# Altium schematic sheet 智能家居-开关-功率测量板.SchDoc
size A4
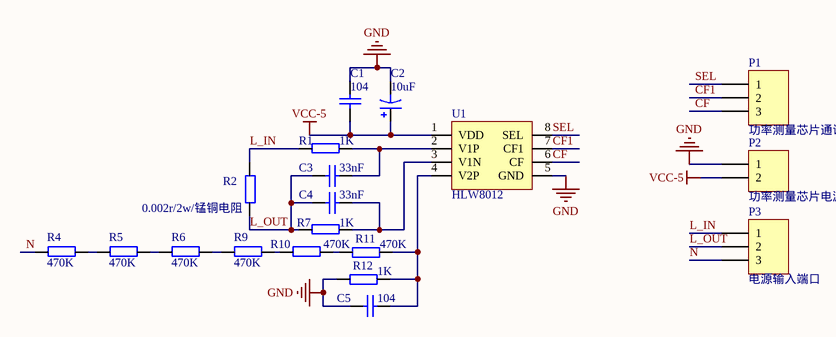
[diagram p0: 智能家居-开关-功率测量板.SchDoc]

## Parts
C1  value 104  [0.1UF]  (hidden comment: Cap)
C2  value 10uF  [CD5]  (hidden comment: Cap Pol1)
C3  value 33nF  [150PF]  (hidden comment: Cap)
C4  value 33nF  [150PF]  (hidden comment: Cap)
C5  value 104  [0.1UF]  (hidden comment: Cap)
P1  功率测量芯片通讯端口  [DG1283]
P2  功率测量芯片电源端口  [DG1282]
P3  电源输入端口  [JK128-500-3P]
R1  1K  [AXIAL-0.3]
R2  0.002r/2w/锰铜电阻  [3216]
R4  470K  [AXIAL-0.3]
R5  470K  [AXIAL-0.3]
R6  470K  [AXIAL-0.3]
R7  1K  [AXIAL-0.3]
R9  470K  [AXIAL-0.3]
R10  470K  [AXIAL-0.3]
R11  470K  [AXIAL-0.3]
R12  1K  [AXIAL0.3]
U1  HLW8012  [SOP-8]

## Nets
GND: C1.1 C2.2 C5.1 P2.1 R12.1 U1.5(GND)
VCC-5: C1.2 C2.1 P2.2 U1.1(VDD)
CF: P1.3 U1.6(CF)
CF1: P1.2 U1.7(CF1)
L_IN: P3.1 R1.2 R2.2
L_OUT: C3.2 C4.1 P3.2 R2.1 R7.2
N: P3.3 R4.2
SEL: P1.1 U1.8(SEL)
NetC3_1: C3.1 R1.1 U1.2(V1P)
NetC4_2: C4.2 R7.1 U1.3(V1N)
NetC5_2: C5.2 R11.2 R12.2 U1.4(V2P)
NetR4_1: R4.1 R5.2
NetR5_1: R5.1 R6.2
NetR6_1: R6.1 R9.2
NetR9_1: R9.1 R10.2
NetR10_1: R10.1 R11.1

## Library data of the parts
C1 C3-C5 = Cap: Capacitor; Published: 8-Jun-2000; LatestRevisionDate: 17-Jul-2002; LatestRevisionNote: Re-released for DXP Platform.; PackageReference: RAD-0.3; Publisher: Altium Limited; PackageDescription: Radial Cap, Thru-Hole; 2 Leads; 0.3 in Pin Spacing
C2 = Cap Pol1: Polarized Capacitor (Radial); Published: 8-Jun-2000; LatestRevisionDate: 17-Jul-2002; LatestRevisionNote: Re-released for DXP Platform.; PackageReference: RB7.6-15; Publisher: Altium Limited; PackageDescription: Polarized Capacitor (Radial); 2 Leads
P1 P3 = Header 3: Header, 3-Pin; LatestRevisionDate: 17-Jul-2002; LatestRevisionNote: Re-released for DXP Platform.; Publisher: Altium Limited
P2 = Header 2: Header, 2-Pin; LatestRevisionDate: 17-Jul-2002; LatestRevisionNote: Re-released for DXP Platform.; Publisher: Altium Limited
R1 R2 R4-R7 R9-R12 = R